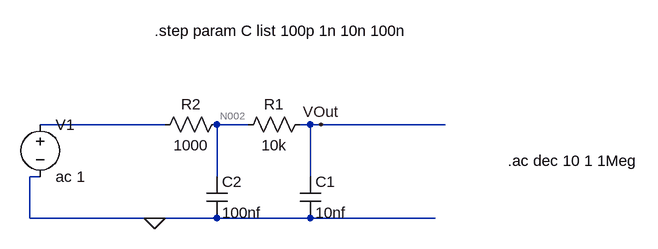
[diagram p0: schematic SecondOrder.asc]
SecondOrder.asc, the LTspice schematic file:
Version 4
SHEET 1 896 680
WIRE 16 160 -176 160
WIRE 144 160 96 160
WIRE 240 160 224 160
WIRE 256 160 240 160
WIRE 448 160 256 160
WIRE -176 240 -192 240
WIRE 96 240 96 160
WIRE 240 240 240 160
WIRE -192 304 -192 240
WIRE 0 304 -192 304
WIRE 96 304 0 304
WIRE 240 304 96 304
WIRE 432 304 240 304
FLAG 0 304 0
FLAG 256 160 VOut
SYMBOL voltage -176 144 R0
WINDOW 123 0 0 Left 0
WINDOW 39 0 0 Left 0
SYMATTR InstName V1
SYMATTR Value ac 1
SYMBOL res 240 144 R90
WINDOW 0 0 56 VBottom 2
WINDOW 3 32 56 VTop 2
SYMATTR InstName R1
SYMATTR Value 10k
SYMBOL cap 224 240 R0
SYMATTR InstName C1
SYMATTR Value 10nf
SYMBOL cap 80 240 R0
SYMATTR InstName C2
SYMATTR Value 100nf
SYMBOL res 112 144 R90
WINDOW 0 0 56 VBottom 2
WINDOW 3 32 56 VTop 2
SYMATTR InstName R2
SYMATTR Value 1000
TEXT 544 216 Left 2 !.ac dec 10 1 1Meg
TEXT 0 16 Left 2 !.step param C list 100p 1n 10n 100n

The netlist it stands for:
* SecondOrder.asc
V1 N001 0 ac 1
R1 VOut N002 10k
C1 VOut 0 10nf
C2 N002 0 100nf
R2 N002 N001 1000
.ac dec 10 1 1Meg
.step param C list 100p 1n 10n 100n
.backanno
.end

* Results of the author's LTspice run, read from the files saved beside the schematic
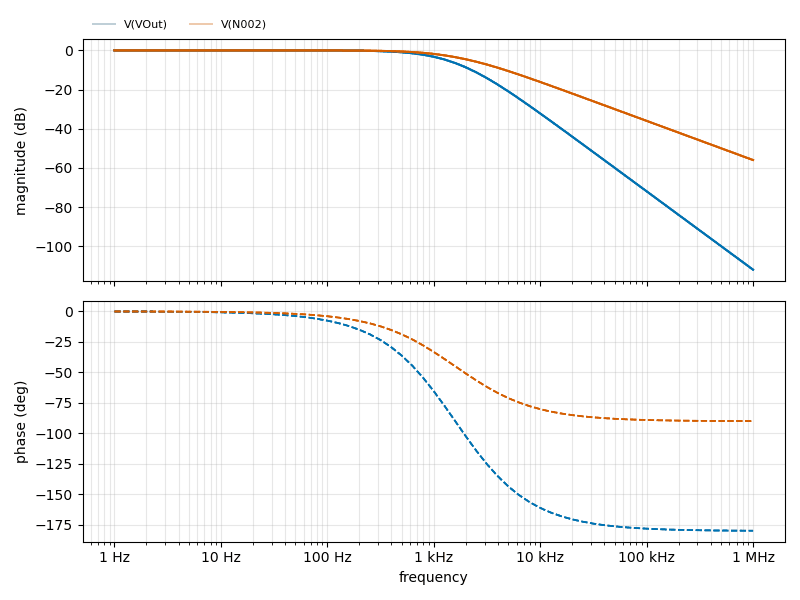
[diagram p1: AC Analysis of SecondOrder.asc, plotted from the saved traces]
* AC Analysis, 4 runs:
*   V(VOut) [c=1e-010]: -0.00 dB at 1 Hz, -111.93 dB at 1 MHz, peak -0.00 dB at 1 Hz, 3 dB below the peak at 950.5 Hz
*   V(VOut) [c=1e-009]: -0.00 dB at 1 Hz, -111.93 dB at 1 MHz, peak -0.00 dB at 1 Hz, 3 dB below the peak at 950.5 Hz
*   V(VOut) [c=1e-008]: -0.00 dB at 1 Hz, -111.93 dB at 1 MHz, peak -0.00 dB at 1 Hz, 3 dB below the peak at 950.5 Hz
*   V(VOut) [c=1e-007]: -0.00 dB at 1 Hz, -111.93 dB at 1 MHz, peak -0.00 dB at 1 Hz, 3 dB below the peak at 950.5 Hz
*   V(N002) [c=1e-010]: -0.00 dB at 1 Hz, -55.96 dB at 1 MHz, peak -0.00 dB at 1 Hz, 3 dB below the peak at 1.429 kHz
*   V(N002) [c=1e-009]: -0.00 dB at 1 Hz, -55.96 dB at 1 MHz, peak -0.00 dB at 1 Hz, 3 dB below the peak at 1.429 kHz
*   V(N002) [c=1e-008]: -0.00 dB at 1 Hz, -55.96 dB at 1 MHz, peak -0.00 dB at 1 Hz, 3 dB below the peak at 1.429 kHz
*   V(N002) [c=1e-007]: -0.00 dB at 1 Hz, -55.96 dB at 1 MHz, peak -0.00 dB at 1 Hz, 3 dB below the peak at 1.429 kHz